# Altium project 243-TGE-Template.PrjPcb
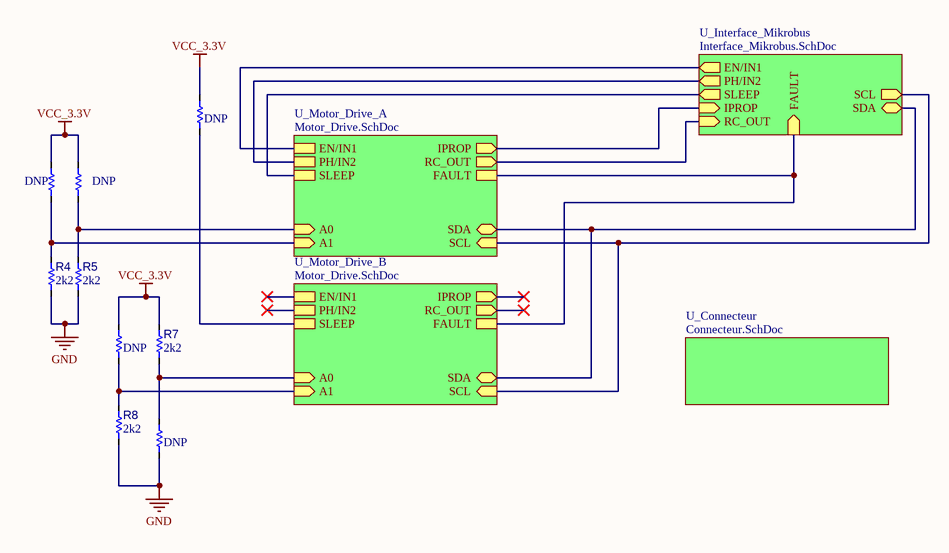
[diagram p0: Page_Tete.SchDoc]
Revision: La Revision; NomDeProjet: Le nom de mon Projet; NomDeLetudiant: Le nom de l'étudiant
4 sheets, 38 parts. Net scope: hierarchical (ports join the sheet entries above them; power ports are global).
Board file: Pcb1.PcbDoc
Sheets:
  Page_Tete.SchDoc
    U_Motor_Drive_A = Motor_Drive.SchDoc
    U_Motor_Drive_B = Motor_Drive.SchDoc
    U_Connecteur = Connecteur.SchDoc
    U_Interface_Mikrobus = Interface_Mikrobus.SchDoc

## Sheet Page_Tete.SchDoc
size A4; SheetNumber: 1; SheetTotal: 4

### Parts
R1  value DNP  [R_1005[0402]]  (hidden comment: Res 2k2 1% 0402)  (no BOM)
R2  value DNP  [R_1005[0402]]  (hidden comment: Res 2k2 1% 0402)  (no BOM)
R3  value DNP  [R_1005[0402]]  (hidden comment: Res 2k2 1% 0402)  (no BOM)
R4  value 2k2  [R_1005[0402]]  (hidden comment: Res 2k2 1% 0402)
R5  value 2k2  [R_1005[0402]]  (hidden comment: Res 2k2 1% 0402)
R6  value DNP  [R_1005[0402]]  (hidden comment: Res 2k2 1% 0402)  (no BOM)
R7  value 2k2  [R_1005[0402]]  (hidden comment: Res 2k2 1% 0402)
R8  value 2k2  [R_1005[0402]]  (hidden comment: Res 2k2 1% 0402)
R9  value DNP  [R_1005[0402]]  (hidden comment: Res 2k2 1% 0402)  (no BOM)

### Sub-sheets
U_Connecteur = Connecteur.SchDoc: no entries
U_Interface_Mikrobus = Interface_Mikrobus.SchDoc: EN/IN1 (out), PH/IN2 (out), SLEEP (out), IPROP (in), SCL (out), SDA (bidir), RC_OUT (in), FAULT (in)
U_Motor_Drive_A = Motor_Drive.SchDoc: EN/IN1, PH/IN2, SLEEP, IPROP (out), FAULT, SCL (in), SDA (bidir), A0 (in), A1 (in), RC_OUT (out)
U_Motor_Drive_B = Motor_Drive.SchDoc: EN/IN1, PH/IN2, SLEEP, IPROP (out), FAULT, SCL (in), SDA (bidir), A0 (in), A1 (in), RC_OUT (out)

### Nets
GND: R4.1 R5.1 R8.1 R9.1
VCC_3.3V: R1.2 R2.2 R3.2 R6.2 R7.2
NetC8A_2: sheet U_Motor_Drive_A/IPROP, sheet U_Interface_Mikrobus/IPROP
NetMB1_2: sheet U_Motor_Drive_A/SLEEP, sheet U_Interface_Mikrobus/SLEEP
NetMB1_3: sheet U_Motor_Drive_A/RC_OUT, sheet U_Interface_Mikrobus/RC_OUT
NetMB1_6: sheet U_Motor_Drive_A/PH/IN2, sheet U_Interface_Mikrobus/PH/IN2
NetMB1_11: sheet U_Motor_Drive_A/SDA, sheet U_Motor_Drive_B/SDA, sheet U_Interface_Mikrobus/SDA
NetMB1_12: sheet U_Motor_Drive_A/SCL, sheet U_Motor_Drive_B/SCL, sheet U_Interface_Mikrobus/SCL
NetMB1_15: sheet U_Motor_Drive_A/FAULT, sheet U_Motor_Drive_B/FAULT, sheet U_Interface_Mikrobus/FAULT
NetMB1_16: sheet U_Motor_Drive_A/EN/IN1, sheet U_Interface_Mikrobus/EN/IN1
NetR1_1: R1.1 ; sheet U_Motor_Drive_B/SLEEP
NetR2_1: R2.1 R4.2 ; sheet U_Motor_Drive_A/A1
NetR3_1: R3.1 R5.2 ; sheet U_Motor_Drive_A/A0
NetR6_1: R6.1 R8.2 ; sheet U_Motor_Drive_B/A1
NetR7_1: R7.1 R9.2 ; sheet U_Motor_Drive_B/A0

### Library data of the parts
R1-R9 = RES008: Resistor type 1; Manufacturer 1: Yageo; Manufacturer Part Number 1: RC0402FR-072K2L; LibRef: RES008; Code CEGEP: RES2.2KSM; Puissance: 1/16W; Max Working Voltage: 50V; Tolerance: 1%; Mounting Technology: SMT; Supplier 1: LCSC; Supplier Part Number 1: C114762; Supplier 2: Digi-Key; Supplier Part Number 2: 311-2.20KLRCT-ND

## Sheet Motor_Drive.SchDoc: drive_motor
size Letter; ApprovedBy: himself; Author: Arthur Bou-Boinne; Organization: Cegep Limoilou; Address1: 1300, 8e Avenue; Address2: Québec, QC; Address3: Canada; Address4: G1J 5L5; SheetNumber: 4; SheetTotal: 4
Used 2 times, as channels U_Motor_Drive_A, U_Motor_Drive_B. Parts and nets are listed once, with the designators drawn on the sheet.
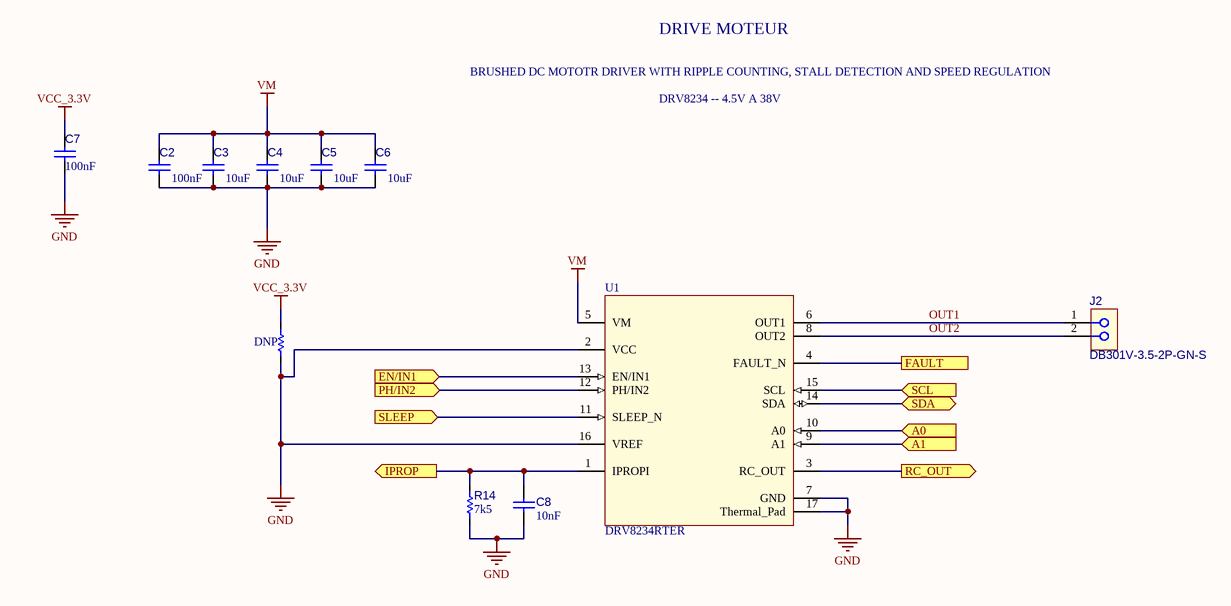
[diagram p1: Motor_Drive.SchDoc]

### Parts
C2  value 100nF  [C_2012[0805]]  (hidden comment: CAP CER 100nF 50V 0805)
C3  value 10uF  [C_2012[0805]]  (hidden comment: CAP CER 10uF 10V X7R 0805)
C4  value 10uF  [C_2012[0805]]  (hidden comment: CAP CER 10uF 10V X7R 0805)
C5  value 10uF  [C_2012[0805]]  (hidden comment: CAP CER 10uF 10V X7R 0805)
C6  value 10uF  [C_2012[0805]]  (hidden comment: CAP CER 10uF 10V X7R 0805)
C7  value 100nF  [C_2012[0805]]  (hidden comment: CAP CER 100nF 50V 0805)
C8  value 10nF  [C_1005[0402]]  (hidden comment: CAP CER 10nF 50V X7R 0402)
J2  DB301V-3.5-2P-GN-S  [CONN_TERM_BLOCK_2POS_3mm5]
R14  value 7k5  [R_1005[0402]]  (hidden comment: Res 7k5 1% 0402)
r2000  value DNP  [R_1005[0402]]  (hidden comment: Res 2k2 1% 0402)  (no BOM)
U1  DRV8234RTER  [U_WQFN50P300X300-16]

### Ports
A0 (in, see Page_Tete[3B]), A1 (in, see Page_Tete[3B]), EN/IN1 (in, see Page_Tete[3B], Interface_Mikrobus[3B]), FAULT (see Page_Tete[3B], Interface_Mikrobus[3B]), IPROP (out, see Page_Tete[3B], Interface_Mikrobus[1B]), PH/IN2 (in, see Page_Tete[3B], Interface_Mikrobus[1B]), RC_OUT (out, see Page_Tete[3B], Interface_Mikrobus[1B]), SCL (in, see Page_Tete[3B], Interface_Mikrobus[3C]), SDA (bidir, see Page_Tete[3B], Interface_Mikrobus[3C]), SLEEP (in, see Page_Tete[3B], Interface_Mikrobus[1B])

### Nets
GND: C2.1 C3.1 C4.2 C5.1 C6.2 C7.1 C8.1 R14.1 r2000.1 U1.2(VCC) U1.7(GND) U1.16(VREF) U1.17(Thermal_Pad)
VCC_3.3V: C7.2 r2000.2
VM: C2.2 C3.2 C4.1 C5.2 C6.1 U1.5(VM)
A0: U1.10(A0) ; port A0
A1: U1.9(A1) ; port A1
EN/IN1: U1.13(EN/IN1) ; port EN/IN1
FAULT: U1.4(FAULT_N) ; port FAULT
IPROP: C8.2 R14.2 U1.1(IPROPI) ; port IPROP
OUT1: J2.1 U1.6(OUT1)
OUT2: J2.2 U1.8(OUT2)
PH/IN2: U1.12(PH/IN2) ; port PH/IN2
RC_OUT: U1.3(RC_OUT) ; port RC_OUT
SCL: U1.15(SCL) ; port SCL
SDA: U1.14(SDA) ; port SDA
SLEEP: U1.11(SLEEP_N) ; port SLEEP

### Channels
U_Motor_Drive_A: designators end in A; ports A0=NetR3_1 A1=NetR2_1 EN/IN1=NetMB1_16 FAULT=NetMB1_15 IPROP=NetC8A_2 PH/IN2=NetMB1_6 RC_OUT=NetMB1_3 SCL=NetMB1_12 SDA=NetMB1_11 SLEEP=NetMB1_2
U_Motor_Drive_B: designators end in B; ports A0=NetR7_1 A1=NetR6_1 EN/IN1=NetU1B_13 FAULT=NetMB1_15 IPROP=NetC8B_2 PH/IN2=NetU1B_12 RC_OUT=NetU1B_3 SCL=NetMB1_12 SDA=NetMB1_11 SLEEP=NetR1_1

### Notes on the sheet
- BRUSHED DC MOTOTR DRIVER WITH RIPPLE COUNTING, STALL DETECTION AND SPEED REGULATION
- DRIVE MOTEUR
- DRV8234 -- 4.5V A 38V
- Titre :
- Conception :
- Date :
- Approbation :
- Heure :
- Révision :
- Feuille
- de
- Fichier :

### Library data of the parts
C2 C7 = CAP008: Capacitor type 1; Manufacturer 1: Yageo; Manufacturer Part Number 1: CC0805KRX7R9BB104; LibRef: CAP008; Code CEGEP: KCOND0142SM; Tolerance: 10%; Dielectric: X7R; Rated Voltage: 50V; Mounting Technology: SMT; Supplier 1: LCSC; Supplier Part Number 1: C49678
C3-C6 = CAP004: Capacitor type 1; Manufacturer 1: muRata; Manufacturer Part Number 1: GRM21BR71A106KE51L; LibRef: CAP004; Code CEGEP: KCOND03SM; Tolerance: 10%; Rated Voltage: 10V; Dielectric: X7R; Mounting Technology: SMT; Supplier 1: LCSC; Supplier Part Number 1: C86038
C8 = CAP017: Capacitor type 1; Manufacturer 1: Yageo; Manufacturer Part Number 1: CC0402KRX7R9BB103; Tolerance: 10%; LibRef: CAP017; Rated Voltage: 50V; Dielectric: X7R; Mounting Technology: SMT; Supplier 1: LCSC; Supplier Part Number 1: C60133
J2 = CONN-3MM5-2POS-TERM-BLOCK: CONN TERM BLOCK 2POS 3.5mm pitch; Manufacturer 1: Dorabo; Supplier 1: LCSC; Supplier Part Number 1: C695629; Manufacturer Part Number 1: DB301V-3.5-2P-GN-S; Mounting Technology: TH
R14 = RES027: Resistor type 1; Manufacturer 1: Yageo; Manufacturer Part Number 1: RC0402FR-077k5L; LibRef: RES027; Puissance: 1/16W; Max Working Voltage: 50V; Tolerance: 1%; Mounting Technology: SMT; Supplier 1: LCSC; Supplier Part Number 1: C137934
r2000 = RES008: as R1 on sheet Page_Tete; Tolerance: 1%; Mounting Technology: SMT; Supplier 1: LCSC; Supplier Part Number 1: C114762; Supplier 2: Digi-Key; Supplier Part Number 2: 311-2.20KLRCT-ND
U1 = U_DRV8234: Brushed DC H-bridge Motor Driver with Ripple Counting, Stall Detection, and Speed Regulation 38V 2A 16-WQFN; Manufacturer 1: Texas Instruments; Mounting Technology: SMT; Manufacturer Part Number 1: DRV8234RTER; Supplier 1: LCSC

## Sheet Connecteur.SchDoc: drive_motor
size Letter; ApprovedBy: Himself; Author: Arthur Bou-Boinne; Organization: Cegep Limoilou; Address1: 1300, 8e Avenue; Address2: Québec, QC; Address3: Canada; Address4: G1J 5L5; SheetNumber: 2; SheetTotal: 4
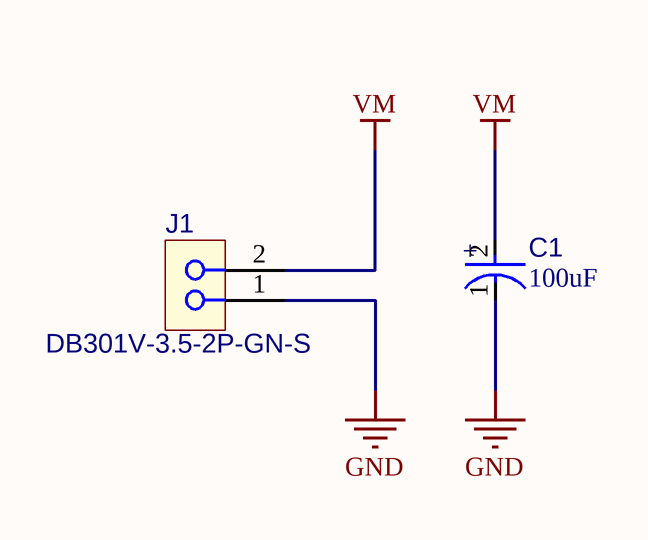
[diagram p2: Connecteur.SchDoc]

### Parts
C1  value 100uF  [C_EL_D10MM-L11MM]
J1  DB301V-3.5-2P-GN-S  [CONN_TERM_BLOCK_2POS_3mm5]

### Nets
GND: C1.1(C) J1.1
VM: C1.2(A) J1.2

### Notes on the sheet
- Titre :
- Conception :
- Date :
- Approbation :
- Heure :
- Révision :
- Feuille
- de
- Fichier :
- (in symbol capacitor_EL) +

### Library data of the parts
C1 = capacitor_EL: Capacitor type EL
J1 = CONN-3MM5-2POS-TERM-BLOCK: as J2 on sheet Motor_Drive; Supplier 1: LCSC; Supplier Part Number 1: C695629; Manufacturer Part Number 1: DB301V-3.5-2P-GN-S; Mounting Technology: TH

## Sheet Interface_Mikrobus.SchDoc: drive_motor
size Letter; ApprovedBy: himself; Author: Arthur Bou-Boinne; Organization: Cegep Limoilou; Address1: 1300, 8e Avenue; Address2: Québec, QC; Address3: Canada; Address4: G1J 5L5; SheetNumber: 3; SheetTotal: 4
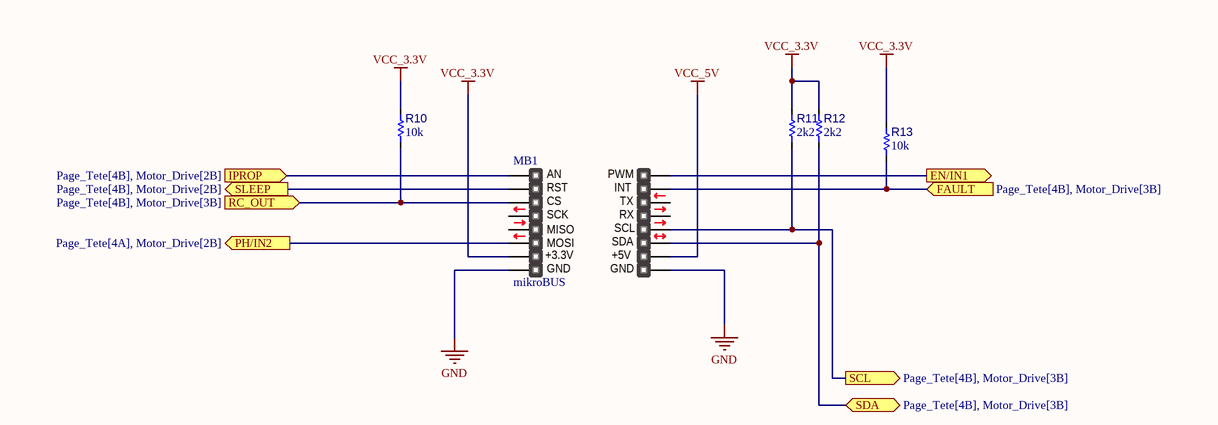
[diagram p3: Interface_Mikrobus.SchDoc]

### Parts
MB1  mikroBUS  [mikroBUS - Large]  (no BOM)
R10  value 10k  [R_1005[0402]]  (hidden comment: Res 10k 1% 0402)
R11  value 2k2  [R_1005[0402]]  (hidden comment: Res 2k2 1% 0402)
R12  value 2k2  [R_1005[0402]]  (hidden comment: Res 2k2 1% 0402)
R13  value 10k  [R_1005[0402]]  (hidden comment: Res 10k 1% 0402)

### Ports
EN/IN1 (out, see Page_Tete[4A], Motor_Drive[2B]), FAULT (in, see Page_Tete[4B], Motor_Drive[3B]), IPROP (in, see Page_Tete[4B], Motor_Drive[2B]), PH/IN2 (out, see Page_Tete[4A], Motor_Drive[2B]), RC_OUT (in, see Page_Tete[4B], Motor_Drive[3B]), SCL (out, see Page_Tete[4B], Motor_Drive[3B]), SDA (bidir, see Page_Tete[4B], Motor_Drive[3B]), SLEEP (out, see Page_Tete[4B], Motor_Drive[2B])

### Nets
GND: MB1.8(GND) MB1.9(GND)
VCC_3.3V: MB1.7(3.3V) R10.2 R11.2 R12.2 R13.2
VCC_5V: MB1.10(5V)
NetC8A_2: MB1.1(AN) ; port IPROP
NetMB1_2: MB1.2(RST) ; port SLEEP
NetMB1_3: MB1.3(CS) R10.1 ; port RC_OUT
NetMB1_6: MB1.6(MOSI) ; port PH/IN2
NetMB1_11: MB1.11(SDA) R12.1 ; port SDA
NetMB1_12: MB1.12(SCL) R11.1 ; port SCL
NetMB1_15: MB1.15(INT) R13.1 ; port FAULT
NetMB1_16: MB1.16(PWM) ; port EN/IN1

Not connected (* = marked no-connect by the designer): MB1 4(SCK) 5(MISO) 13(TX) 14(RX)

### Notes on the sheet
- Titre :
- Conception :
- Date :
- Approbation :
- Heure :
- Révision :
- Feuille
- de
- Fichier :
- (in symbol mikroBUS compatible add-on board) +3.3V; +5V

### Library data of the parts
MB1 = mikroBUS compatible add-on board
R10 R13 = RES003: Resistor type 1; Manufacturer 1: Yageo; Manufacturer Part Number 1: RC0402FR-0710KL; LibRef: RES003; Puissance: 1/16W; Max Working Voltage: 50V; Tolerance: 1%; Mounting Technology: SMT; Supplier 1: LCSC; Supplier Part Number 1: C60490
R11 R12 = RES008: as R1 on sheet Page_Tete; Tolerance: 1%; Mounting Technology: SMT; Supplier 1: LCSC; Supplier Part Number 1: C114762; Supplier 2: Digi-Key; Supplier Part Number 2: 311-2.20KLRCT-ND

## Nets that join several sheets
GND: Page_Tete (R4.1 R5.1 R8.1 R9.1), U_Motor_Drive_A (13 pins), U_Motor_Drive_B (13 pins), Connecteur (C1.1 J1.1), Interface_Mikrobus (MB1.8 MB1.9)
VCC_3.3V: Page_Tete (5 pins), U_Motor_Drive_A (C7A.2 r2000A.2), U_Motor_Drive_B (C7B.2 r2000B.2), Interface_Mikrobus (5 pins)
VM: U_Motor_Drive_A (6 pins), U_Motor_Drive_B (6 pins), Connecteur (C1.2 J1.2)
NetC8A_2: U_Motor_Drive_A (C8A.2 R14A.2 U1A.1), Interface_Mikrobus (MB1.1)
NetMB1_2: U_Motor_Drive_A (U1A.11), Interface_Mikrobus (MB1.2)
NetMB1_3: U_Motor_Drive_A (U1A.3), Interface_Mikrobus (MB1.3 R10.1)
NetMB1_6: U_Motor_Drive_A (U1A.12), Interface_Mikrobus (MB1.6)
NetMB1_11: U_Motor_Drive_A (U1A.14), U_Motor_Drive_B (U1B.14), Interface_Mikrobus (MB1.11 R12.1)
NetMB1_12: U_Motor_Drive_A (U1A.15), U_Motor_Drive_B (U1B.15), Interface_Mikrobus (MB1.12 R11.1)
NetMB1_15: U_Motor_Drive_A (U1A.4), U_Motor_Drive_B (U1B.4), Interface_Mikrobus (MB1.15 R13.1)
NetMB1_16: U_Motor_Drive_A (U1A.13), Interface_Mikrobus (MB1.16)
NetR1_1: Page_Tete (R1.1), U_Motor_Drive_B (U1B.11)
NetR2_1: Page_Tete (R2.1 R4.2), U_Motor_Drive_A (U1A.9)
NetR3_1: Page_Tete (R3.1 R5.2), U_Motor_Drive_A (U1A.10)
NetR6_1: Page_Tete (R6.1 R8.2), U_Motor_Drive_B (U1B.9)
NetR7_1: Page_Tete (R7.1 R9.2), U_Motor_Drive_B (U1B.10)

## Assembly variants
RES DNP: not fitted R11 R12 R13 R14 R15
Variant of 243-TGE-Template: all parts fitted